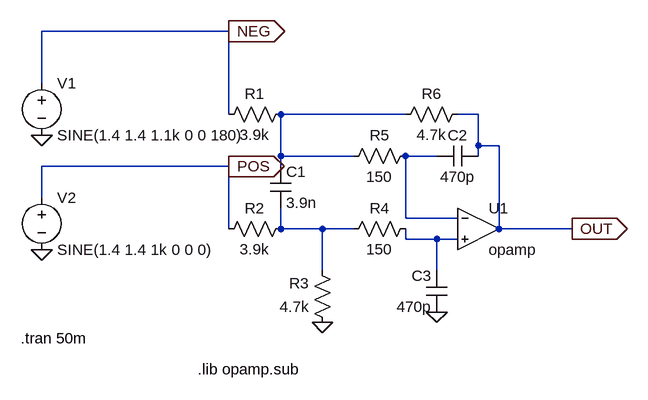
[diagram p0: schematic Output stage as in the datasheet.asc]
Output stage as in the datasheet.asc, the LTspice schematic file:
Version 4
SHEET 1 880 680
WIRE 224 -32 -64 -32
WIRE -64 48 -64 -32
WIRE 224 96 224 -32
WIRE 496 96 304 96
WIRE 608 96 576 96
WIRE 608 144 608 96
WIRE 640 144 608 144
WIRE 304 160 304 96
WIRE 416 160 304 160
WIRE 544 160 496 160
WIRE 608 160 608 144
WIRE 224 176 -64 176
WIRE 304 176 304 160
WIRE -64 224 -64 176
WIRE 496 256 496 160
WIRE 576 256 496 256
WIRE 224 272 224 176
WIRE 304 272 304 240
WIRE 368 272 304 272
WIRE 416 272 368 272
WIRE 640 272 640 144
WIRE 752 272 640 272
WIRE 496 288 496 272
WIRE 544 288 496 288
WIRE 576 288 544 288
WIRE 368 336 368 272
WIRE 544 336 544 288
FLAG -64 304 0
FLAG -64 128 0
FLAG 368 416 0
FLAG 544 400 0
FLAG 752 272 OUT
IOPIN 752 272 Out
FLAG 224 -32 NEG
IOPIN 224 -32 Out
FLAG 224 176 POS
IOPIN 224 176 Out
SYMBOL voltage -64 32 R0
WINDOW 123 0 0 Left 0
WINDOW 39 0 0 Left 0
SYMATTR InstName V1
SYMATTR Value SINE(1.4 1.4 1.1k 0 0 180)
SYMBOL res 320 80 R90
WINDOW 0 0 56 VBottom 2
WINDOW 3 32 56 VTop 2
SYMATTR InstName R1
SYMATTR Value 3.9k
SYMBOL res 320 256 R90
WINDOW 0 0 56 VBottom 2
WINDOW 3 32 56 VTop 2
SYMATTR InstName R2
SYMATTR Value 3.9k
SYMBOL res 384 432 R180
WINDOW 0 36 76 Left 2
WINDOW 3 36 40 Left 2
SYMATTR InstName R3
SYMATTR Value 4.7k
SYMBOL res 400 288 R270
WINDOW 0 32 56 VTop 2
WINDOW 3 0 56 VBottom 2
SYMATTR InstName R4
SYMATTR Value 150
SYMBOL res 400 176 R270
WINDOW 0 32 56 VTop 2
WINDOW 3 0 56 VBottom 2
SYMATTR InstName R5
SYMATTR Value 150
SYMBOL res 480 112 R270
WINDOW 0 32 56 VTop 2
WINDOW 3 0 56 VBottom 2
SYMATTR InstName R6
SYMATTR Value 4.7k
SYMBOL cap 288 176 R0
SYMATTR InstName C1
SYMATTR Value 3.9n
SYMBOL cap 608 144 R90
WINDOW 0 0 32 VBottom 2
WINDOW 3 32 32 VTop 2
SYMATTR InstName C2
SYMATTR Value 470p
SYMBOL cap 560 400 R180
WINDOW 0 24 56 Left 2
WINDOW 3 24 8 Left 2
SYMATTR InstName C3
SYMATTR Value 470p
SYMBOL OpAmps\\opamp 608 208 R0
SYMATTR InstName U1
SYMBOL voltage -64 208 R0
WINDOW 123 0 0 Left 0
WINDOW 39 0 0 Left 0
SYMATTR InstName V2
SYMATTR Value SINE(1.4 1.4 1k 0 0 0)
TEXT -96 440 Left 2 !.tran 50m
TEXT 176 488 Left 2 !.lib opamp.sub

The netlist it stands for:
* Output stage as in the datasheet.asc
V1 NEG 0 SINE(1.4 1.4 1.1k 0 0 180)
R1 N001 NEG 3.9k
R2 N003 POS 3.9k
R3 0 N003 4.7k
R4 N003 N004 150
R5 N001 N002 150
R6 N001 OUT 4.7k
C1 N001 N003 3.9n
C2 OUT N002 470p
C3 0 N004 470p
XU1 N002 N004 OUT opamp Aol=100K GBW=10Meg  ; pins invin noninvin out
V2 POS 0 SINE(1.4 1.4 1k 0 0 0)
.tran 50m
.lib opamp.sub
.backanno
.end